# EAGLE design SparkFun_STUSB4500_USB-PD (EAGLE 9.6.0)
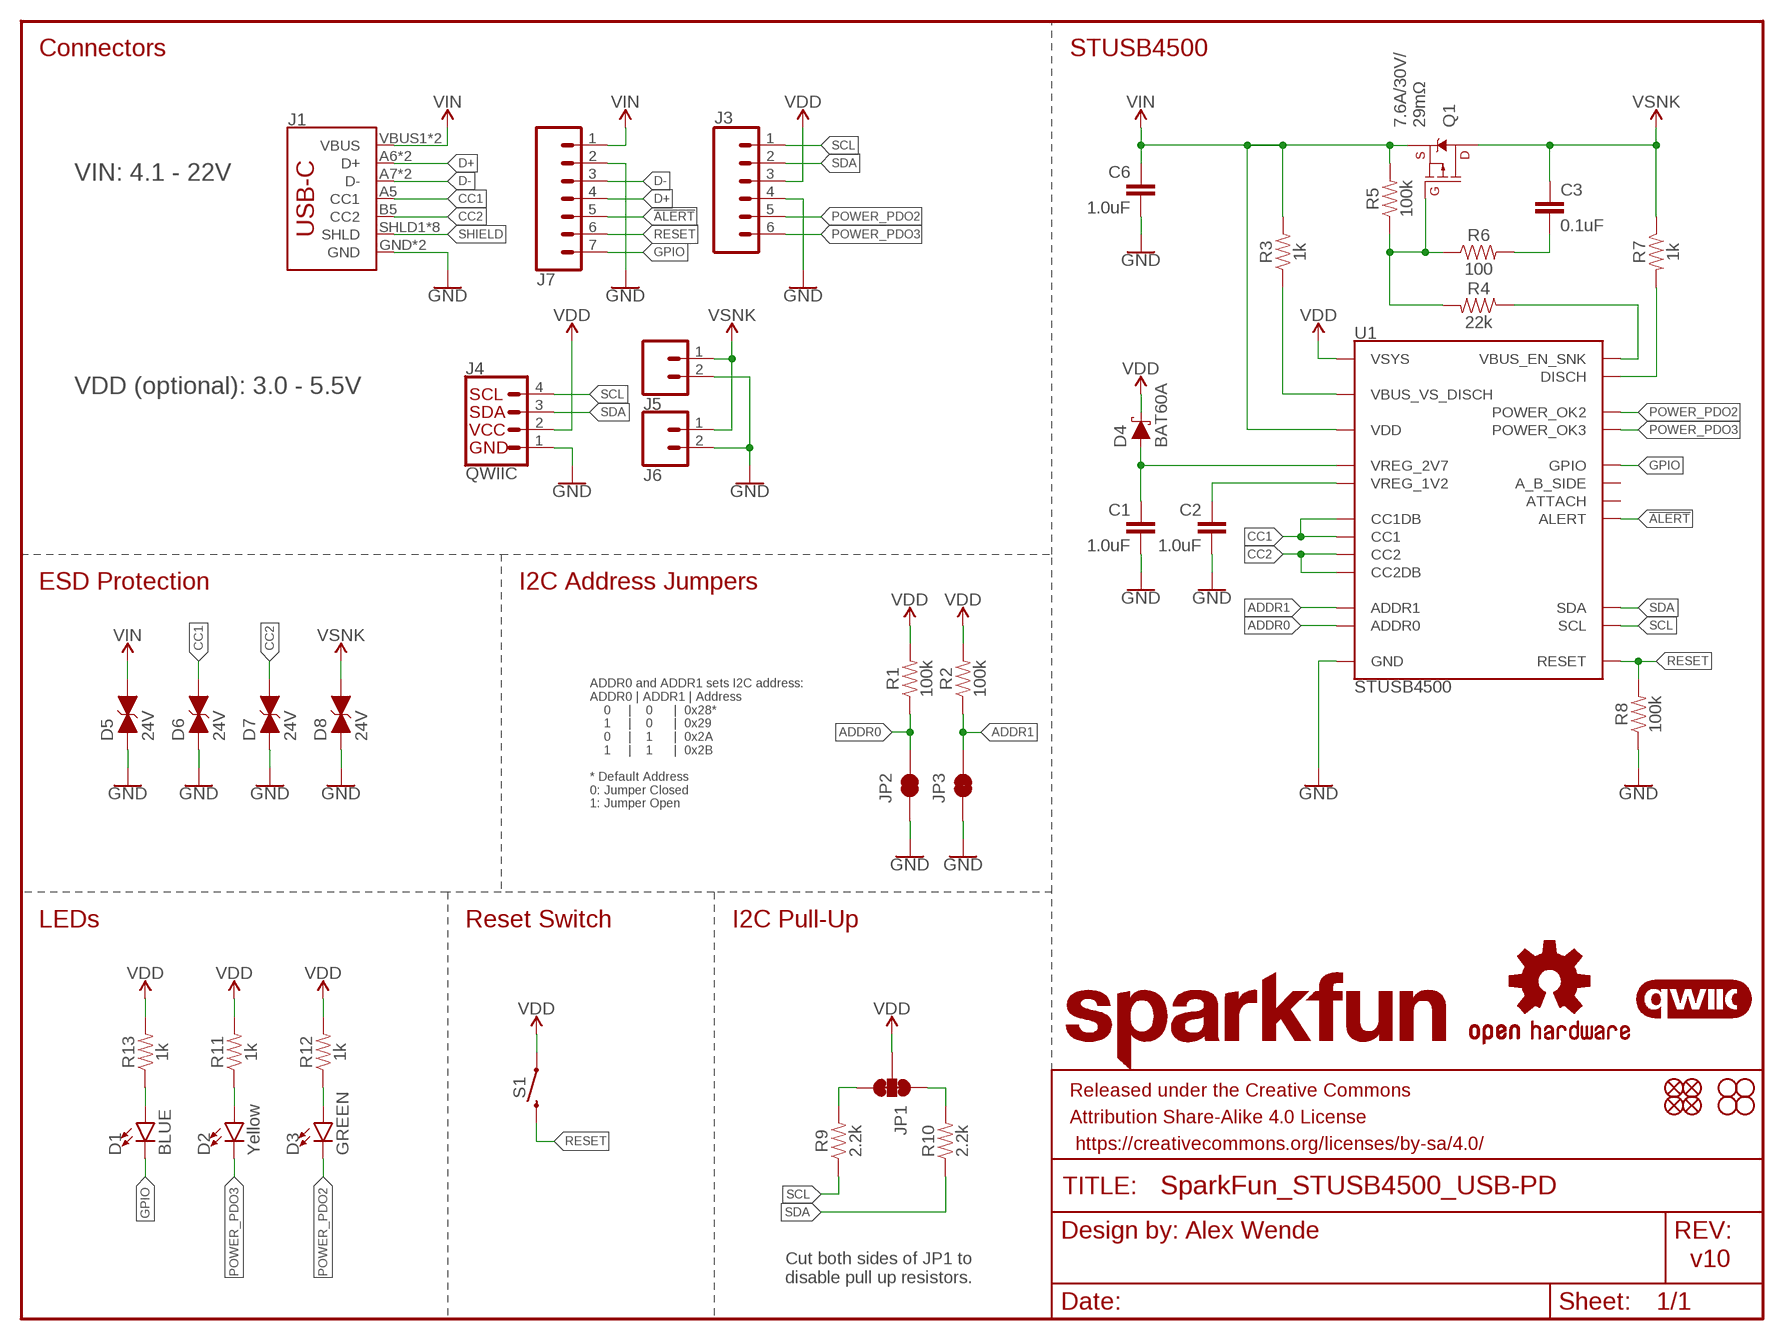
[diagram p0: schematic, sheet 1]

## Parts
C1  1.0uF  1.0UF-0603-16V-10%  [0603]
C2  1.0uF  1.0UF-0603-16V-10%  [0603]
C3  0.1uF  0.1UF-0603-100V-10%  [0603]
C6  1.0uF  1.0UF-0603-16V-10%  [0603]
D1  BLUE  LED-BLUE0603  [LED-0603]
D2  Yellow  LED-YELLOW0603  [LED-0603]
D3  GREEN  LED-GREEN0603  [LED-0603]
D4  BAT60A  DIODE-SCHOTTKY-BAT60A  [SOD-323]
D5  24V  DIODE_TVS  [0603]
D6  24V  DIODE_TVS  [0603]
D7  24V  DIODE_TVS  [0603]
D8  24V  DIODE_TVS  [0603]
FD1  FIDUCIALUFIDUCIAL  [FIDUCIAL-MICRO]
FD2  FIDUCIALUFIDUCIAL  [FIDUCIAL-MICRO]
FD3  FIDUCIALUFIDUCIAL  [FIDUCIAL-MICRO]
FD4  FIDUCIALUFIDUCIAL  [FIDUCIAL-MICRO]
FRAME1  FRAME-LETTER  [CREATIVE_COMMONS]
H1  STAND-OFF  [STAND-OFF]
H2  STAND-OFF  [STAND-OFF]
H3  STAND-OFF  [STAND-OFF]
H4  STAND-OFF  [STAND-OFF]
J1  USB_C2-LAYER  [USB-C-16P]
J3  CONN_06NO_SILK_NO_POP  [1X06_NO_SILK]
J4  QWIIC  QWIIC_CONNECTORJS-1MM  [JST04_1MM_RA]
J5  CONN_023.5MM  [SCREWTERMINAL-3.5MM-2]
J6  CONN_021X02_NO_SILK  [1X02_NO_SILK]
J7  CONN_07NO_SILK  [1X07_NO_SILK]
JP1  JUMPER-SMT_3_2-NC_TRACE_NO-SILK  [SMT-JUMPER_3_2-NC_TRACE_NO-SILK]
JP2  JUMPER-SMT_2_NC_TRACE_NO-SILK  [SMT-JUMPER_2_NC_TRACE_NO-SILK]
JP3  JUMPER-SMT_2_NC_TRACE_NO-SILK  [SMT-JUMPER_2_NC_TRACE_NO-SILK]
LOGO1  OSHW-LOGOS  [OSHW-LOGO-S]
LOGO2  SFE_LOGO_NAME.1_INCH  [SFE_LOGO_NAME_.1]
LOGO3  QWIIC_LOGO_5MM  [QWIIC_5MM]
Q1  9A/30V/15mΩ  MOSFET_PCH-STL9P3LLH6  [8-POWERVDFN-3X3]
R1  100k  100KOHM-0603-1/10W-1%  [0603]
R2  100k  100KOHM-0603-1/10W-1%  [0603]
R3  1k  1KOHM-0603-1/10W-1%  [0603]
R4  22k  22KOHM-0603-1/10W-1%  [0603]
R5  100k  100KOHM-0603-1/10W-1%  [0603]
R6  100  100OHM-0603-1/10W-1%  [0603]
R7  1k  1KOHM-0603-1/10W-1%  [0603]
R8  100k  100KOHM-0603-1/10W-1%  [0603]
R9  2.2k  2.2KOHM-0603-1/10W-1%  [0603]
R10  2.2k  2.2KOHM-0603-1/10W-1%  [0603]
R11  1k  1KOHM-0603-1/10W-1%  [0603]
R12  1k  1KOHM-0603-1/10W-1%  [0603]
R13  1k  1KOHM-0603-1/10W-1%  [0603]
S1  MOMENTARY-SWITCH-SPST-SMD-4.6X2.8MM  [TACTILE_SWITCH_SMD_4.6X2.8MM]
U1  STUSB4500  [QFN-24]

## Nets
1.2V: C2.1 U1.P$21(VREG_1V2)
2.7V: C1.1 D4.A U1.P$23(VREG_2V7)
!ALERT: J7.5 U1.P$19(ALERT)
ADDR0: JP2.2 R1.1 U1.P$12(ADDR0)
ADDR1: JP3.2 R2.1 U1.P$13(ADDR1)
CC1: D6.2(C) J1.A5(CC1) U1.P$1(CC1DB) U1.P$2(CC1)
CC2: D7.2(C) J1.B5(CC2) U1.P$4(CC2) U1.P$5(CC2DB)
D+: J1.A6(D+) J1.B6(D+) J7.4
D-: J1.A7(D-) J1.B7(D-) J7.3
DISCH: R7.2 U1.P$9(DISCH)
EN_SNK: R4.1 U1.P$16(VBUS_EN_SNK)
GND: C1.2 C2.2 C6.2 D5.1(A) D6.1(A) D7.1(A) D8.1(A) J1.GND J1.GND2(GND) J3.4 J4.1 J5.2 J6.2 J7.2 JP2.1 JP3.1 R8.1 U1.P$10(GND) U1.P$25(GND)
GPIO: D1.C J7.7 U1.P$15(GPIO)
N$1: D2.A R11.1
N$2: D3.A R12.1
N$5: JP1.3 R9.2
N$6: JP1.1 R10.2
N$8: Q1.4(G) R4.2 R5.1 R6.1
N$10: C3.2 R6.2
N$13: D1.A R13.1
POWER_PDO2: D3.C J3.5 U1.P$20(POWER_OK2)
POWER_PDO3: D2.C J3.6 U1.P$14(POWER_OK3)
RESET: J7.6 R8.2 S1.3 S1.4 U1.P$6(RESET)
SCL: J3.1 J4.4 R9.1 U1.P$7(SCL)
SDA: J3.2 J4.3 R10.1 U1.P$8(SDA)
SHIELD: J1.SHLD1(SHLD) J1.SHLD2(SHLD) J1.SHLD3(SHLD) J1.SHLD4(SHLD) J1.SHLD5(SHLD) J1.SHLD6(SHLD) J1.SHLD7(SHLD) J1.SHLD8(SHLD)
VBUS_VS_DISCH: R3.1 U1.P$18(VBUS_VS_DISCH)
VDD: D4.C J3.3 J4.2 JP1.2 R1.2 R2.2 R11.2 R12.2 R13.2 S1.1 S1.2 U1.P$22(VSYS)
VIN: C6.1 D5.2(C) J1.VBUS1(VBUS) J1.VBUS2(VBUS) J7.1 Q1.1(S) Q1.2(S) Q1.3(S) R3.2 R5.2 U1.P$24(VDD)
VSNK: C3.1 D8.2(C) J5.1 J6.1 Q1.5@1(D) Q1.5@2(D) Q1.5@3(D) R7.1
Unconnected: U1.P$11(ATTACH) U1.P$17(A_B_SIDE)

## Notes on the sheet
- Connectors | STUSB4500
- 7.6A/30V/
  29mΩ
- VIN: 4.1 - 22V
- VDD (optional): 3.0 - 5.5V
- ESD Protection | I2C Address Jumpers
- ADDR0 and ADDR1 sets I2C address:
  ADDR0 | ADDR1 | Address
      0     |    0      |  0x28*
      1     |    0      |  0x29
      0     |    1      |  0x2A
      1     |    1      |  0x2B
  
  * Default Address
  0: Jumper Closed
  1: Jumper Open
- LEDs | Reset Switch | I2C Pull-Up
- Alex Wende
- v10
- Cut both sides of JP1 to 
  disable pull up resistors.

## Library data of the parts
C1 C2 C6 = SparkFun-Capacitors:1.0UF: 1µF ceramic capacitors A capacitor is a passive two-terminal electrical component used to store electrical energy temporarily in an electric field.; PROD_ID: CAP-00868
C3 = SparkFun-Capacitors:0.1UF: 0.1µF ceramic capacitors A capacitor is a passive two-terminal electrical component used to store electrical energy temporarily in an electric field.; PROD_ID: CAP-08390
D1 = SparkFun-LED:LED-BLUE: Blue SMD LED Used in manufacturing of various products at SparkFun Packages: 0603 - SMD 0603 package [Product Link] <http://www.digikey.com/product-detail/en/SMLE12BC7TT86/511-1589-2-ND/1641808> 1206 - SMD1206 package [Product Link] <http://www.digikey.com/product-detail/en/lite-on-inc/LTST-C150TBKT/160-1643-1-ND/573584> SparkFun Products: ESP8266 Thing-Dev Board <https://www.sparkfun.com/products/13711> RedBoard <https://www.sparkfun.com/products/12757>; PROD_ID: DIO-08575
D2 = SparkFun-LED:LED-YELLOW: Yellow SMD LED Used in manufacturing several products at SparkFun. Packages: 0603 - SMD 0603 package[Product Link] <http://www.kingbrightusa.com/product.asp?catalog_name=LED&product_id=APT1608SYCK> 0603 -SMART - SMART SMD 0603 package (more efficient/more expensive) [Product Link] <http://www.osram-os.com/osram_os/en/products/product-catalog/led-light-emitting-diodes/smartled-0603/ly-l29k/index.jsp> LilyPad - SMD1206 package[Product Datasheet] <https://www.sparkfun.com/datasheets/DevTools/LilyPad/Q150YUS4.pdf> SparkFun Products: Blynk Board <https://www.sparkfun.com/products/13794> IOIO-OTG <https://www.sparkfun.com/products/13613> XBee Explorer Serial <https://www.sparkfun.com/products/13225>; PROD_ID: DIO-09003
D3 = SparkFun-LED:LED-GREEN: Green SMD LED Used in manufacturing of various products at SparkFun Packages: 0603 - SMD 0603 package [Product Link] <http://www.futureelectronics.com/en/technologies/semiconductors/optoelectronics/leds/Pages/9894312-LTST-C190GKT.aspx?CrossPart=HSMG-C190&IM=0> LilyPad 1206 - SMD1206 LilyPad package [Product Link] <http://www.futureelectronics.com/en/Technologies/Product.aspx?ProductID=IN150NGHARVATEKCORPORATION2049943&IM=0> 1206 - SMD1206 package [Product Link] <http://www.futureelectronics.com/en/technologies/semiconductors/optoelectronics/leds/Pages/8315665-LTST-C150KGKT.aspx?IM=0> 1206 Bottom Mount -SMD 1206 Bottom Mount [Product Link] <http://www.digikey.com/product-detail/en/lite-on-inc/LTST-C230KGKT/160-1456-1-ND/386854> SparkFun Products: Pro Mini 328 -5V <https://www.sparkfun.com/products/821> RedBoard <https://www.sparkfun.com/products/12757> MP3 Trigger <https://www.sparkfun.com/products/13720> Makey Makey <https://www.sparkfun.com/products/11076>; PROD_ID: DIO-00821
D4 = SparkFun-DiscreteSemi:DIODE-SCHOTTKY: Schottky diode A Schottky diode is a semiconductor diode which has a low forward voltage drop and a very fast switching action.; PROD_ID: DIO-14072; VALUE: 3A/10V/280mV
D5-D8 = SparkFun-DiscreteSemi:DIODE_TVS; PROD_ID: DIO-14502
FD1-FD4 = SparkFun-Aesthetics:FIDUCIAL: Fiducial Alignment Points Point-of-reference for pick-and-place machines and other optical instruments.
FRAME1 = SparkFun-Aesthetics:FRAME-LETTER: Schematic Frame - Letter Standard 8.5x11 US Letter frame
H1-H4 = SparkFun-Hardware:STAND-OFF: Stand Off Drill holes for mechanically mounting via screws, standoffs, etc. Note: Use the keepout ring to avoid running the screw head into surrounding components. Variant Overviews STAND-OFF - Mechanical footprint for a #4 phillips button head screw. STAND-OFF-TIGHT - Mechanical footprint for a #4 phillips button head screw, Example SparkFun Products Screw - Phillips Head (1/4", 4-40, 10 pack) <https://www.sparkfun.com/products/10453> (PRT-10453) Screw - Phillips Head (1/2", 4-40, 10 pack) <https://www.sparkfun.com/products/10452> (PRT-10452) Screw - Phillips Head (3/4", 4-40, 10 pack) <https://www.sparkfun.com/products/10451> (PRT-10451) Screw - Phillips Head (1", 4-40, 10 pack) <https://www.sparkfun.com/products/10450> (PRT-10450)
J1 = SparkFun-Connectors:USB_C: USB Type C 16Pin Connector Super Speed pins not available on the 16-pin purely SMD connector so this part is best for USB 2.0 implementations. D1 and D2 are tied together enabling D+/- no matter which way the cable is plugged into the connector. The two channel configuration pins (CC1/2) are exposed. These are normally connected to ground via 5.1k resistors but can be reconfigured for high current/high power applications.; PROD_ID: CONN-14122
J3 = SparkFun-Connectors:CONN_06: Multi connection point. Often used as Generic Header-pin footprint for 0.1 inch spaced/style header connections On any of the 0.1 inch spaced packages, you can populate with these: Break Away Headers - Straight <https://www.sparkfun.com/products/116> (PRT-00116) Break Away Male Headers - Right Angle <https://www.sparkfun.com/products/553> (PRT-00553) Female Headers <https://www.sparkfun.com/products/115> (PRT-00115) Break Away Headers - Machine Pin <https://www.sparkfun.com/products/117> (PRT-00117) Break Away Female Headers - Swiss Machine Pin <https://www.sparkfun.com/products/743> (PRT-00743) Arduino Stackable Header - 6 Pin <https://www.sparkfun.com/products/9280> (PRT-09280) For SCREWTERMINALS and SPRING TERMINALS visit here: Screw Terimnals on SparkFun.com <https://www.sparkfun.com/search/results?term=Screw+Terminals> (5mm/3.5mm/2.54mm spacing) This device is also useful as a general connection point to wire up your design to another part of your project. Our various solder wires solder well into these plated through hole pads. Hook-Up Wire - Assortment (Stranded, 22 AWG) <https://www.sparkfun.com/products/11375> (PRT-11375) Hook-Up Wire - Assortment (Solid Core, 22 AWG) <https://www.sparkfun.com/products/11367> (PRT-11367) View the entire wire category on our website here <https://www.sparkfun.com/categories/141>
J4 = SparkFun-Connectors:QWIIC_CONNECTOR: SparkFun I2C Standard Qwiic Connector An SMD 1mm pitch JST connector makes it easy and quick (get it? Qwiic?) to connect I2C devices to each other. The Qwiic system <http://www.sparkfun.com/qwiic> enables fast and solderless connection between popular platforms and various sensors and actuators. We carry 200mm <https://www.sparkfun.com/products/14204>, 100mm <https://www.sparkfun.com/products/14205>, 50mm <https://www.sparkfun.com/products/14206>, and breadboard friendly <https://www.sparkfun.com/products/14207> Qwiic cables. We also offer 10 pcs strips <https://www.sparkfun.com/products/14323> the SMD connectors.; PROD_ID: CONN-13694; VALUE: QWIIC_RIGHT_ANGLE
J5 = SparkFun-Connectors:CONN_02: Multi connection point. Often used as Generic Header-pin footprint for 0.1 inch spaced/style header connections On any of the 0.1 inch spaced packages, you can populate with these: Break Away Headers - Straight <https://www.sparkfun.com/products/116> (PRT-00116) Break Away Male Headers - Right Angle <https://www.sparkfun.com/products/553> (PRT-00553) Female Headers <https://www.sparkfun.com/products/115> (PRT-00115) Break Away Headers - Machine Pin <https://www.sparkfun.com/products/117> (PRT-00117) Break Away Female Headers - Swiss Machine Pin <https://www.sparkfun.com/products/743> (PRT-00743) For SCREWTERMINALS and SPRING TERMINALS visit here: Screw Terimnals on SparkFun.com <https://www.sparkfun.com/search/results?term=Screw+Terminals> (5mm/3.5mm/2.54mm spacing) This device is also useful as a general connection point to wire up your design to another part of your project. Our various solder wires solder well into these plated through hole pads. Hook-Up Wire - Assortment (Stranded, 22 AWG) <https://www.sparkfun.com/products/11375> (PRT-11375) Hook-Up Wire - Assortment (Solid Core, 22 AWG) <https://www.sparkfun.com/products/11367> (PRT-11367) View the entire wire category on our website here <https://www.sparkfun.com/categories/141> Special notes: Molex polarized connector foot print use with: PRT-08233 with associated crimp pins and housings. 2.54_SCREWTERM for use with PRT-10571. 3.5mm Screw Terminal footprints for PRT-08084 5mm Screw Terminal footprints for use with PRT-08432; PROD_ID: CONN-08399
J6 = SparkFun-Connectors:CONN_02: Multi connection point. Often used as Generic Header-pin footprint for 0.1 inch spaced/style header connections On any of the 0.1 inch spaced packages, you can populate with these: Break Away Headers - Straight <https://www.sparkfun.com/products/116> (PRT-00116) Break Away Male Headers - Right Angle <https://www.sparkfun.com/products/553> (PRT-00553) Female Headers <https://www.sparkfun.com/products/115> (PRT-00115) Break Away Headers - Machine Pin <https://www.sparkfun.com/products/117> (PRT-00117) Break Away Female Headers - Swiss Machine Pin <https://www.sparkfun.com/products/743> (PRT-00743) For SCREWTERMINALS and SPRING TERMINALS visit here: Screw Terimnals on SparkFun.com <https://www.sparkfun.com/search/results?term=Screw+Terminals> (5mm/3.5mm/2.54mm spacing) This device is also useful as a general connection point to wire up your design to another part of your project. Our various solder wires solder well into these plated through hole pads. Hook-Up Wire - Assortment (Stranded, 22 AWG) <https://www.sparkfun.com/products/11375> (PRT-11375) Hook-Up Wire - Assortment (Solid Core, 22 AWG) <https://www.sparkfun.com/products/11367> (PRT-11367) View the entire wire category on our website here <https://www.sparkfun.com/categories/141> Special notes: Molex polarized connector foot print use with: PRT-08233 with associated crimp pins and housings. 2.54_SCREWTERM for use with PRT-10571. 3.5mm Screw Terminal footprints for PRT-08084 5mm Screw Terminal footprints for use with PRT-08432
J7 = SparkFun-Connectors:CONN_07: Multi connection point. Often used as Generic Header-pin footprint for 0.1 inch spaced/style header connections On any of the 0.1 inch spaced packages, you can populate with these: Break Away Headers - Straight <https://www.sparkfun.com/products/116> (PRT-00116) Break Away Male Headers - Right Angle <https://www.sparkfun.com/products/553> (PRT-00553) Female Headers <https://www.sparkfun.com/products/115> (PRT-00115) Break Away Headers - Machine Pin <https://www.sparkfun.com/products/117> (PRT-00117) Break Away Female Headers - Swiss Machine Pin <https://www.sparkfun.com/products/743> (PRT-00743) For SCREWTERMINALS and SPRING TERMINALS visit here: Screw Terimnals on SparkFun.com <https://www.sparkfun.com/search/results?term=Screw+Terminals> (5mm/3.5mm/2.54mm spacing) This device is also useful as a general connection point to wire up your design to another part of your project. Our various solder wires solder well into these plated through hole pads. Hook-Up Wire - Assortment (Stranded, 22 AWG) <https://www.sparkfun.com/products/11375> (PRT-11375) Hook-Up Wire - Assortment (Solid Core, 22 AWG) <https://www.sparkfun.com/products/11367> (PRT-11367) View the entire wire category on our website here <https://www.sparkfun.com/categories/141> Special notes: Molex polarized connector foot print use with SKU : PRT-08231 with associated crimp pins and housings. 1MM SMD Version SKU: PRT-10208 NOTES ON THE VARIANTS LOCK and LOCK_LONGPADS... This footprint was designed to help hold the alignment of a through-hole component (i.e. 6-pin header) while soldering it into place. You may notice that each hole has been shifted either up or down by 0.005 of an inch from it's more standard position (which is a perfectly straight line). This slight alteration caused the pins (the squares in the middle) to touch the edges of the holes. Because they are alternating, it causes a "brace" to hold the component in place. 0.005 has proven to be the perfect amount of "off-center" position when using our standard breakaway headers. Although looks a little odd when you look at the bare footprint, once you have a header in there, the alteration is very hard to notice. Also,if you push a header all the way into place, it is covered up entirely on the bottom side.
JP1 = SparkFun-Jumpers:JUMPER-SMT_3_2-NC_TRACE: Normally closed trace jumper (2 of 2 connections) This jumper has a trace between all three pads so they are normally closed (NC). Use a razor knife to open the connection(s). For best results follow the IPC guidelines for cutting traces: Cutout at least 0.063 mm (0.005 in). Remove all loose material to clean up the cut area. Seal the cut with an approved epoxy. Reapply solder to reclose the connection(s).
JP2 JP3 = SparkFun-Jumpers:JUMPER-SMT_2_NC_TRACE: Normally closed trace jumper This jumper has a trace between two pads so it's normally closed (NC). Use a razor knife to open the connection. For best results follow the IPC guidelines for cutting traces: Cutout at least 0.063 mm (0.005 in). Remove all loose material to clean up the cut area. Seal the cut with an approved epoxy. Reapply solder to reclose the connection.
LOGO1 = SparkFun-Aesthetics:OSHW-LOGO: Open-Source Hardware (OSHW) Logo This logo indicates the piece of hardware it is found on incorporates a OSHW license and/or adheres to the definition of open source hardware found here: http://freedomdefined.org/OSHW
LOGO2 = SparkFun-Aesthetics:SFE_LOGO_NAME: SparkFun Font Logo This is the SparkFun name logo. The logo on the schematic will always be the same size; the package variant is the height of the flame part of the logo (or the height the flame would be, if it were drawn). Default layer for the logo on the board is tSilk.
LOGO3 = SparkFun-Aesthetics:QWIIC_LOGO: Qwiic Logos for placement on schematic and PCB. The 5.5mm silk logo is best for placing next to Qwiic connector.
Q1 = SparkFun-DiscreteSemi:MOSFET_PCH: P-channel MOSFETs Voltage controlled devices that allow control of high current outputs. SparkFun Products: SparkFun ESP32 Thing <https://www.sparkfun.com/products/13907> SparkFun ESP8266 Thing <https://www.sparkfun.com/products/13231> SparkFun Pi Servo HAT V2 <https://www.sparkfun.com/products/15316> DMG2305UX-7 (20V/4.2A/SOT23-3); PROD_ID: TRANS-14715
R1 R2 R5 R8 = SparkFun-Resistors:100KOHM: 100kΩ resistor A resistor is a passive two-terminal electrical component that implements electrical resistance as a circuit element. Resistors act to reduce current flow, and, at the same time, act to lower voltage levels within circuits. - Wikipedia; PROD_ID: RES-07828
R3 R7 R11-R13 = SparkFun-Resistors:1KOHM: 1kΩ resistor A resistor is a passive two-terminal electrical component that implements electrical resistance as a circuit element. Resistors act to reduce current flow, and, at the same time, act to lower voltage levels within circuits. - Wikipedia; PROD_ID: RES-07856
R4 = SparkFun-Resistors:22KOHM: 22kΩ resistor A resistor is a passive two-terminal electrical component that implements electrical resistance as a circuit element. Resistors act to reduce current flow, and, at the same time, act to lower voltage levels within circuits. - Wikipedia; PROD_ID: RES-07853
R6 = SparkFun-Resistors:100OHM: 100Ω resistor A resistor is a passive two-terminal electrical component that implements electrical resistance as a circuit element. Resistors act to reduce current flow, and, at the same time, act to lower voltage levels within circuits. - Wikipedia; PROD_ID: RES-07863
R9 R10 = SparkFun-Resistors:2.2KOHM: 2.2kΩ resistor A resistor is a passive two-terminal electrical component that implements electrical resistance as a circuit element. Resistors act to reduce current flow, and, at the same time, act to lower voltage levels within circuits. - Wikipedia; PROD_ID: RES-08272
S1 = SparkFun-Switches:MOMENTARY-SWITCH-SPST: Momentary Switch (Pushbutton) - SPST Normally-open (NO) SPST momentary switches (buttons, pushbuttons). Variants PTH-12MM - 12mm square, through-hole Momentary Pushbutton Switch - 12mm Square <https://www.sparkfun.com/products/9190> (COM-09190) PTH-6.0MM, PTH-6.0MM-KIT - 6.0mm square, through-hole Mini Pushbutton Switch <https://www.sparkfun.com/products/97> (COM-00097) KIT package intended for soldering kit's - only one side of pads' copper is exposed. PTH-RIGHT-ANGLE-KIT - Right-angle, through-hole Right Angle Tactile Button <https://www.sparkfun.com/products/10791> - Used on SparkFun BigTime Watch Kit <https://www.sparkfun.com/products/11734> SMD-12MM - 12mm square, surface-mount Tactile Button - SMD (12mm) <https://www.sparkfun.com/products/12993> (COM-12993) Used on SparkFun PicoBoard <https://www.sparkfun.com/products/11888> SMD-4.5MM - 4.5mm Square Trackball Switch Used on SparkFun Blackberry Trackballer Breakout <https://www.sparkfun.com/products/13169> SMD-4.6MMX2.8MM - 4.60mm x 2.80mm, surface mount Used on SparkFun SAMD21 Mini Breakout <https://www.sparkfun.com/products/13664> SMD-5.2MM, SMD-5.2-REDUNDANT - 5.2mm square, surface-mount Mini Pushbutton Switch - SMD <https://www.sparkfun.com/products/8720> (COM-08720) Used on Arduino Pro Mini <https://www.sparkfun.com/products/11114> REDUNDANT package connects both switch circuits together SMD-6.0X3.5MM - 6.0 x 3.5mm, surface mount Momentary Reset Switch SMD <https://www.sparkfun.com/products/8229> (COM-08229) SMD-6.2MM-TALL - 6.2mm square, surface mount Tactile Button - SMD (6mm) <https://www.sparkfun.com/products/12992> Used on SparkFun Digital Sandbox <https://www.sparkfun.com/products/12651> SMD-RIGHT-ANGLE - Right-angle, surface mount Used on SparkFun Block for Intel® Edison - Arduino <https://www.sparkfun.com/products/13036>; PROD_ID: SWCH-13065
U1 = SparkFun-IC-Power:STUSB4500; PROD_ID: IC-14684

## Board
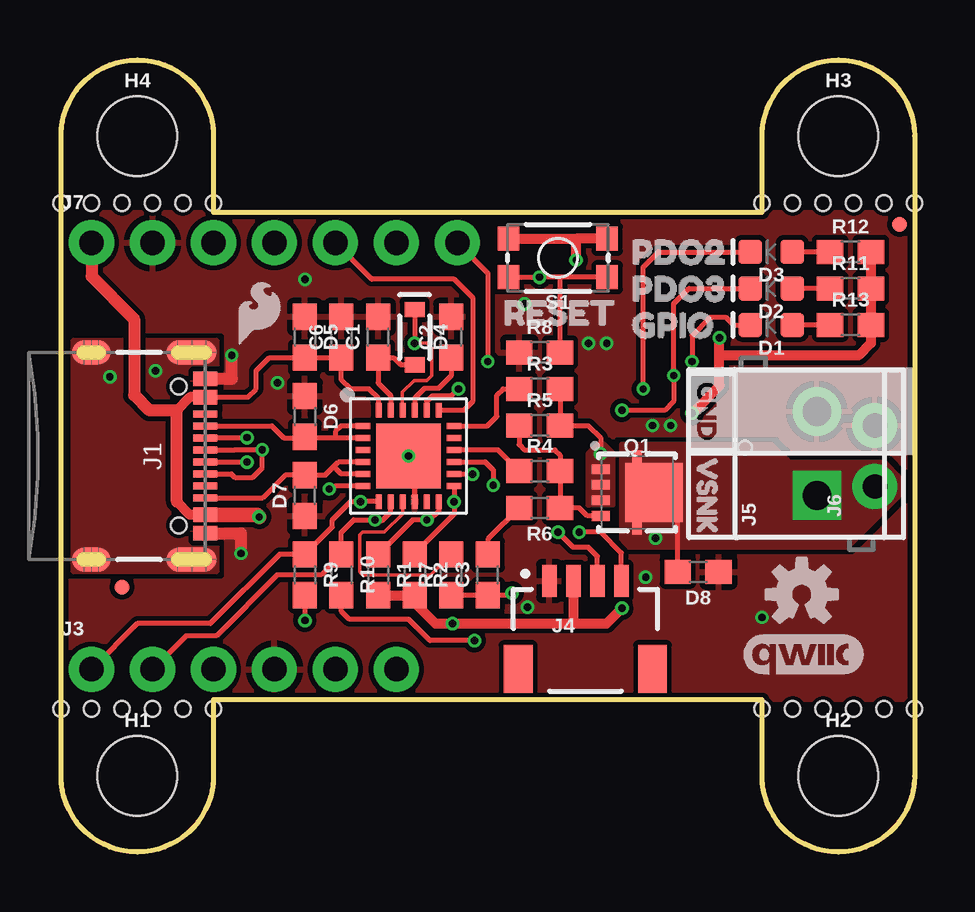
[diagram p1: board, top side]
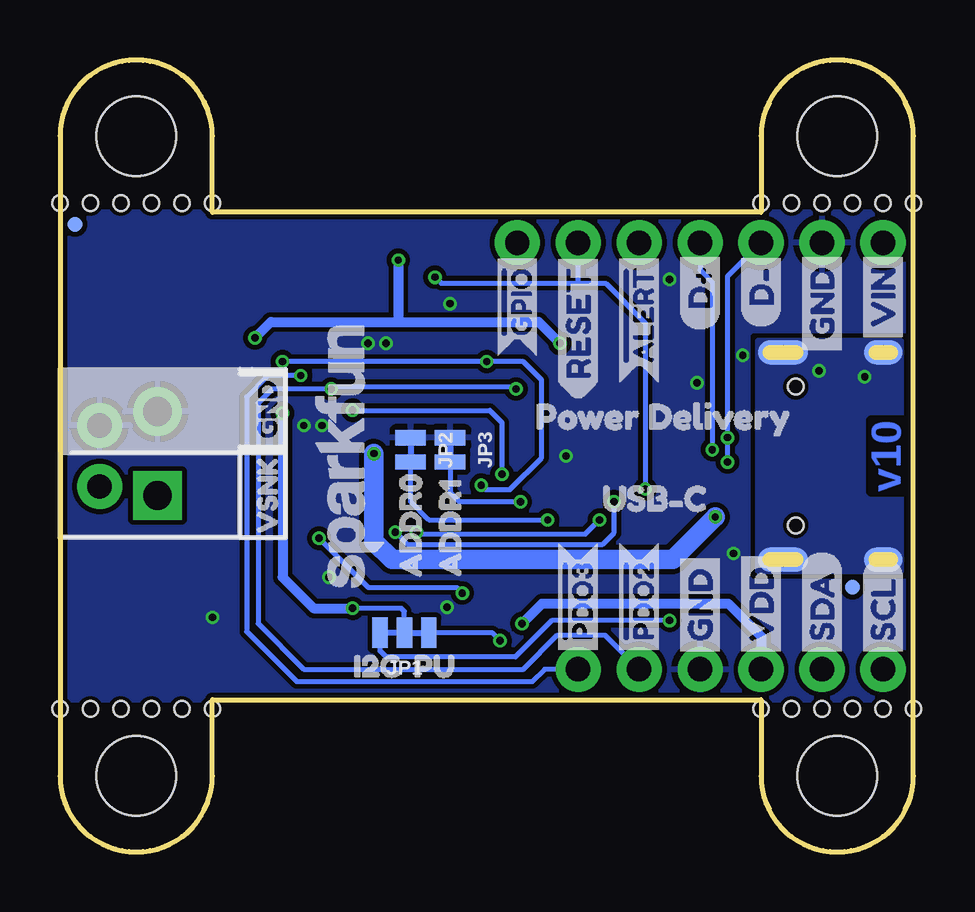
[diagram p2: board, bottom side, seen from below]

Size 35.56 x 33.02 mm. Coordinates in mm from the lower left corner, seen from the top.
Outline: 6.35,26.67 29.21,26.67 29.21,29.84 arc-90 32.38,33.02 arc-90 35.56,29.84 35.56,3.17 arc-90 32.38,0 arc-90 29.21,3.17 29.21,6.35 6.35,6.35 6.35,3.17 arc-90 3.17,0 arc-90 0,3.17 0,29.84 arc-90 3.17,33.02 arc-90 6.35,29.84 6.35,26.67
Copper layers (1*16): Top 0.035mm / dielectric 1.5mm / Bottom 0.035mm
Design rules "SparkFun-2-layer-FAB-LIMIT": minimum track width 4mil, minimum drill 6mil, track to track 4mil, track to pad 4mil, pad to pad 4mil, via to via 4mil, smd to smd 4mil, copper to edge 4mil, drill to drill 4mil, minimum pad ring 5mil, minimum via ring 5mil, stop-mask expansion 4mil, vias tented up to drill 25mil, thermal gap 10mil
Holes 0.64 mm at 3.81,5.97 2.54,5.97 1.27,5.97 0,5.97 5.08,5.97 6.35,5.97 33.02,5.97 31.75,5.97 30.48,5.97 29.21,5.97 34.29,5.97 35.56,5.97 2.54,27.05 3.81,27.05 5.08,27.05 6.35,27.05 1.27,27.05 0,27.05 31.75,27.05 33.02,27.05 34.29,27.05 35.56,27.05 30.48,27.05 29.21,27.05
tRestrict: 4 lines

### Footprints (pad centres in the part's own frame; a part is rotated, then mirrored left to right if it is on the bottom)
0603 = smd 1.1 x 1: 1 -0.85,0; 2 0.85,0
LED-0603 = smd 1 x 1: A -0.877,0; C 0.877,0
SOD-323 = smd 0.63 x 0.83: A 1.15,0; C -1.15,0
FIDUCIAL-MICRO = smd 0.635 x 0.635: 1 0,0
STAND-OFF = hole 3.302: 0,0
USB-C-16P = smd 0.3 x 1: A5 -1.25,-0.34; A6 -0.25,-0.34; A7 0.25,-0.34; A8 1.25,-0.34; B5 1.75,-0.34; B6 0.75,-0.34; B7 -0.75,-0.34; B8 -1.75,-0.34 | smd 0.6 x 1: GND -3.225,-0.34; GND2 3.225,-0.34; VBUS1 -2.45,-0.34; VBUS2 2.45,-0.34 | smd 1 x 2.1: SHLD1 -4.32,-0.915; SHLD2 4.32,-0.915 | smd 1 x 2.1 bottom: SHLD3 -4.32,-0.915; SHLD4 4.32,-0.915 | smd 1 x 1.6: SHLD5 -4.32,-5.095; SHLD8 4.32,-5.095 | smd 1 x 1.6 bottom: SHLD6 -4.32,-5.095; SHLD7 4.32,-5.095 | hole 0.65: -2.89,-1.445; 2.89,-1.445
1X06_NO_SILK = drill 1.016 pad 1.88: 1 0,0; 2 2.54,0; 3 5.08,0; 4 7.62,0; 5 10.16,0; 6 12.7,0
JST04_1MM_RA = smd 0.6 x 1.35: 1 -1.5,0; 2 -0.5,0; 3 0.5,0; 4 1.5,0 | smd 1.2 x 2: NC1 2.8,-3.675; NC2 -2.8,-3.675
SCREWTERMINAL-3.5MM-2 = drill 1.2 pad 2.032 square: 1 0,0 | drill 1.2 pad 2.032: 2 3.5,0
1X02_NO_SILK = drill 1.016 pad 1.88: 1 0,0; 2 2.54,0
1X07_NO_SILK = drill 1.016 pad 1.88: 1 0,0; 2 2.54,0; 3 5.08,0; 4 7.62,0; 5 10.16,0; 6 12.7,0; 7 15.24,0
SMT-JUMPER_3_2-NC_TRACE_NO-SILK = smd 0.635 x 1.27: 1 -1.016,0; 2 0,0; 3 1.016,0
SMT-JUMPER_2_NC_TRACE_NO-SILK = smd 0.635 x 1.27: 1 -0.508,0; 2 0.508,0
8-POWERVDFN-3X3 = smd 0.4 x 0.75: 1 -0.975,-1.525; 2 -0.325,-1.525; 3 0.325,-1.525; 4 0.975,-1.525 | smd 2.45 x 2.4: 5@1 0,0.7 | smd 0.53 x 0.4: 5@2 -1.49,0; 5@3 1.49,0
TACTILE_SWITCH_SMD_4.6X2.8MM = smd 0.9 x 1: 1 -2.05,-0.8; 2 2.05,-0.8; 3 2.05,0.8; 4 -2.05,0.8
QFN-24 = smd 0.6 x 0.25: P$1 -1.9,1.25; P$2 -1.9,0.75; P$3 -1.9,0.25; P$4 -1.9,-0.25; P$5 -1.9,-0.75; P$6 -1.9,-1.25; P$13 1.9,-1.25; P$14 1.9,-0.75; P$15 1.9,-0.25; P$16 1.9,0.25; P$17 1.9,0.75; P$18 1.9,1.25 | smd 0.25 x 0.6: P$7 -1.25,-1.9; P$8 -0.75,-1.9; P$9 -0.25,-1.9; P$10 0.25,-1.9; P$11 0.75,-1.9; P$12 1.25,-1.9; P$19 1.25,1.9; P$20 0.75,1.9; P$21 0.25,1.9; P$22 -0.25,1.9; P$23 -0.75,1.9; P$24 -1.25,1.9 | smd 2.7 x 2.7: P$25 0,0

### Placement (x,y rotation side)
C1  13.21,21.46 90 top
C2  16.26,21.46 90 top
C3  17.78,11.56 90 top
C6  11.68,21.46 90 top
D1  29.59,21.97 180 top
D2  29.59,23.5 180 top
D3  29.59,25.02 180 top
D4  14.73,21.46 270 top
D5  10.16,21.46 270 top
D6  10.16,18.16 270 top
D7  10.16,14.86 90 top
D8  26.54,11.68 180 top
FD1  2.54,11.05 0 top
FD2  34.92,26.16 0 top
FD3  34.92,26.16 0 bottom
FD4  2.54,11.05 0 bottom
FRAME1  -8.89,-19.43 0 top  (outside the outline)
H1  3.17,3.17 0 top
H2  32.38,3.17 0 top
H3  32.38,29.84 0 top
H4  3.17,29.84 0 top
J1  6.35,16.51 270 top
J3  1.27,7.62 0 top
J4  21.84,11.3 0 top
J5  31.5,14.86 90 top
J6  33.91,15.24 90 top
J7  1.27,25.4 0 top
JP1  21.21,9.14 180 bottom
JP2  20.95,16.76 270 bottom
JP3  19.3,16.76 270 bottom
LOGO1  30.86,10.74 0 top
LOGO2  23.5,16.51 90 bottom
LOGO3  30.91,8.26 0 top
Q1  24,14.99 270 top
R1  13.21,11.56 270 top
R2  14.73,11.56 270 top
R3  19.94,19.3 0 top
R4  19.94,15.88 0 top
R5  19.94,17.78 0 top
R6  19.94,14.35 180 top
R7  16.26,11.56 90 top
R8  19.94,20.83 0 top
R9  10.16,11.56 270 top
R10  11.68,11.56 270 top
R11  32.89,23.5 0 top
R12  32.89,25.02 0 top
R13  32.89,21.97 0 top
S1  20.7,24.77 180 top
U1  14.48,16.51 0 top
U$1  [VDD2]  6.35,7.87 90 bottom
U$2  [GND6]  8.89,7.87 90 bottom
U$3  [SDA11]  3.81,7.87 90 bottom
U$4  [SCL12]  1.27,7.87 90 bottom
U$5  [#GPIO0]  16.51,20.42 90 bottom
U$7  [D#8]  6.35,21.84 90 bottom
U$8  [D#7]  8.89,21.72 90 bottom
U$9  [USB#C1]  13.89,14.73 0 bottom
U$10  [RESET10]  13.97,18.8 90 bottom
U$11  [GND6]  3.81,20.45 90 bottom
U$12  [VIN6]  1.27,20.95 90 bottom
U$13  [I2C2]  24.13,7.75 0 bottom
U$14  [PU3]  21.59,7.75 0 bottom
U$15  [ADDR00]  20.95,10.69 90 bottom
U$16  [ADDR11]  19.3,10.69 90 bottom
U$17  [RESET7]  17.53,22.48 0 top
U$18  [GPIO1]  22.86,21.97 0 top
U$19  [PDO24]  22.86,25.02 0 top
U$20  [PDO35]  22.86,23.5 0 top
U$21  [VSNK1]  26.92,17.14 270 top
U$22  [GND0]  26.92,20.32 270 top
U$23  [GND0]  26.92,16.51 90 bottom
U$24  [VSNK1]  26.92,12.57 90 bottom
U$25  [SFE_LOGO_FLAME_.1]  8.26,22.48 0 top
U$26  [#ALERT0]  11.43,19.3 90 bottom
U$27  [_POWER_DELIVERY2]  17.02,18.16 0 bottom
U$29  [#PDO20]  11.43,7.75 90 bottom
U$30  [#PDO31]  13.97,7.75 90 bottom

### Tracks (layer width: path | path; a pad name or v marks a point on that pad's centre or on a via)
1.2V
  Top 0.203: C2.1 16.26,19.86 15.73,19.33 15.14,19.33 14.73,18.92 U1.P$21
2.7V
  Top 0.203: U1.P$23 13.73,19.04 13.21,19.56 C1.1 13.86,20.61 14.15,20.31 D4.A
!ALERT
  Top 0.203: J7.5 12.95,23.88 16.38,23.88 17.14,23.11 17.14,18.77 16.78,18.41 U1.P$19
ADDR0  (via drill 0.3)
  Top 0.203: U1.P$12 15.73,14.2 15.37,13.84 v15.24,13.84 14.64,13.84 R1.1
  Bottom 0.203: v15.24,13.84 20.19,13.84 20.95,14.61 JP2.2
ADDR1  (via drill 0.3)
  Top 0.203: U1.P$13 v16.38,14.61 16.38,14.09 14.73,12.45 R2.1
  Bottom 0.203: JP3.2 19.3,14.99 18.92,14.61 v16.38,14.61
CC1
  Top 0.203: U1.P$2 11.43,17.26 | 11.43,17.26 10.21,17.26 | 10.21,17.26 D6.2 | J1.A5 8.78,17.76 9.28,17.26 10.21,17.26 | U1.P$1 11.66,17.76 11.43,17.53 11.43,17.26
CC2
  Top 0.203: J1.B5 8.4,14.76 9.35,15.71 D7.2 11.01,15.71 11.37,16.07 | 11.37,16.07 11.56,16.26 U1.P$4 | 11.37,16.07 11.67,15.76 U1.P$5
D+  (via drill 0.3)
  Top 0.203: J1.B6 7.1,15.76 7.24,15.62 7.99,15.62 8.38,16.01 v8.38,16.78 8.37,16.76 7.24,16.76 J1.A6
  Bottom 0.203: v8.38,16.78 8.38,23.75 8.83,24.19 8.89,24.26 J7.4
D-  (via drill 0.3)
  Top 0.203: J1.A7 v7.75,16.26 | J1.B7 6.01,17.28 v7.75,17.28
  Bottom 0.203: v7.75,16.26 v7.75,17.28 7.75,24 J7.3
DISCH
  Top 0.152: U1.P$9 14.23,14.1 13.46,13.34 12.57,13.34 12.45,13.21 12.45,11.68 12.57,11.56 15.41,11.56 R7.2
EN_SNK
  Top 0.203: R4.1 18.2,16.76 U1.P$16
GND  (via drill 0.3)
  Top 0.203: U1.P$10 14.73,16.26 U1.P$25 14.23,16.76
  Top 0.508: J1.GND 7.11,19.73 v7.11,20.7 | J1.GND2 7.49,13.29 v7.49,12.45
  other vias: 14.48,16.51 24.36,11.46 19.3,22.86 9.02,19.56 19.43,10.21 10.16,23.88 29.21,9.78 25.4,17.78 22.73,21.21 21.97,21.21 24.64,17.78
  pour Top (isolate 0.203, rank 2): 0,26.67 35.56,26.67 35.56,6.35 0,6.35
  pour Bottom (isolate 0.203, rank 2): 0,26.67 35.56,26.67 35.56,6.35 0,6.35
GPIO  (via drill 0.3)
  Top 0.203: v18.01,15.29 18.01,15.92 17.67,16.26 U1.P$15 | D1.C 28.03,21.97 27.72,22.28 27.03,22.28 26.29,21.54 v26.29,20.45 | J7.7 17.78,24.13 v17.78,20.45
  Bottom 0.203: v18.01,15.29 17.83,15.11 16.82,15.11 15.49,16.43 15.49,19.68 16.26,20.45 v17.78,20.45 v26.29,20.45
N$1
  Top 0.203: R11.1 D2.A
N$2
  Top 0.203: R12.1 D3.A
N$5  (via drill 0.3)
  Top 0.203: R9.2 v10.16,9.65
  Bottom 0.203: v10.16,9.65 15.06,9.65 16.59,8.13 21.97,8.13 22.23,8.38 JP1.3
N$6  (via drill 0.3)
  Top 0.203: R10.2 11.68,10.03 12.01,9.7 14.48,9.7 15.37,8.81 v17.22,8.81
  Bottom 0.203: v17.22,8.81 17.55,9.14 JP1.1
N$8
  Top 0.203: R5.1 19.09,16.98 19.3,16.76 20.57,16.76 20.79,16.55 R4.2 R6.1 21.59,14.35 21.93,14.01 Q1.4
N$10
  Top 0.203: R6.2 17.78,13.04 C3.2
N$13
  Top 0.203: R13.1 D1.A
POWER_PDO2  (via drill 0.3)
  Top 0.203: v24.26,19.3 24.26,24.38 24.89,25.02 D3.C | v16.56,19.3 16.26,19 15.44,19 15.23,18.78 U1.P$20
  Bottom 0.203: v16.56,19.3 16.66,19.41 24.18,19.41 24.26,19.33 v24.26,19.3 26.72,19.3 27.3,18.72 27.3,9.53 25.4,7.62 16.26,7.62 14.83,9.04 12.85,9.04 J3.5
POWER_PDO3  (via drill 0.3)
  Top 0.203: U1.P$14 v17.14,15.76 v17.14,15.75 | v23.37,18.41 25.15,18.41 25.53,18.8 v25.53,19.86 25.53,22.86 26.16,23.5 D2.C
  Bottom 0.203: v23.37,18.41 17.65,18.41 17.14,17.91 v17.14,15.75 | v25.53,19.86 26.9,19.86 27.79,18.97 27.79,9.2 25.7,7.11 15.88,7.11 15.37,7.62 J3.6
RESET  (via drill 0.3)
  Top 0.203: U1.P$6 11.44,15.26 11.31,15.13 v11.18,15.13 | S1.4 20.79,23.96 | S1.3 v19.94,23.96 20.79,23.96 | R8.2 20.79,23.96
  Bottom 0.203: v11.18,15.13 11.18,22.06 12.83,23.71 13.97,23.71 | v19.94,23.96 19.68,23.71 13.97,23.71 | 13.97,23.71 J7.6
SCL  (via drill 0.3)
  Top 0.203: J4.4 23.34,12.47 22.48,13.34 v21.59,13.34 | U1.P$7 v12.47,14.61 12.06,14.61 11.3,13.84 11.3,13.55 R9.1 9.11,12.41 6.22,9.53 3.17,9.53 J3.1
  Bottom 0.203: v21.59,13.34 21.08,12.83 12.95,12.83 12.47,13.31 v12.47,14.61
SDA  (via drill 0.3)
  Top 0.203: J4.3 22.34,12.33 21.97,12.7 21.34,12.7 v20.7,13.34 | U1.P$8 13.73,14.17 13.39,13.83 13.14,13.83 13.13,13.84 v13.08,13.84 12.19,13.84 11.67,13.32 R10.1 10.83,11.56 9.02,11.56 6.48,9.02 5.21,9.02 J3.2
  Bottom 0.203: v20.7,13.34 20.62,13.26 13.66,13.26 v13.08,13.84
SHIELD  (via drill 0.3)
  other vias: 3.94,20.07 2.03,19.81
  pour Top (isolate 0.203, no thermals): 0.51,21.34 6.48,21.34 6.48,11.68 0.51,11.68
  pour Bottom (isolate 0.203, no thermals): 6.48,21.34 0.51,21.34 0.51,11.68 6.48,11.68
VBUS_VS_DISCH
  Top 0.203: U1.P$18 17.76,17.76 18.16,18.16 18.16,19.05 18.41,19.3 R3.1
VDD  (via drill 0.3)
  Top 0.152: v14.73,21.21 15.24,21.21 15.44,21.01 15.44,19.86 15.24,19.66 14.71,19.66 14.22,19.18 U1.P$22
  Top 0.203: D4.C v14.73,21.21 | U1.P$22
  Top 0.406: v26.29,18.29 27.43,19.43 v27.43,21.44 27.43,20.7 33.23,20.7 33.74,21.21 R13.2 R11.2 R12.2 | v23.37,10.16 22.73,9.53 21.34,9.53 | 21.34,9.53 v16.31,9.53 15.6,9.53 14.73,10.39 R2.2 R1.2 | J4.2 21.34,9.53 | S1.2 21.46,25.57 | S1.1 21.46,25.57 | v21.46,24.68 21.46,25.57
  Bottom 0.203: v23.37,10.16 21.34,10.16 21.21,10.03 JP1.2
  Bottom 0.406: v27.43,21.44 26.77,22.1 21.46,22.1 | 21.46,22.1 15.62,22.1 v14.73,21.21 | v26.29,18.29 26.29,11.46 24.99,10.16 v23.37,10.16 | v21.46,24.68 21.46,22.1 | v16.31,9.53 15.47,10.36 7.72,10.36 6.35,8.99 J3.3
VIN  (via drill 0.3)
  Top 0.203: R3.2 R5.2 21.97,17.78 22.48,17.27 v22.48,16.61 | J1.VBUS1 7.78,18.96 8.13,19.3 8.13,20.07 8.68,20.61 D5.2 C6.1 11.68,19.68 12.06,19.3 12.83,19.3 13.23,18.9 U1.P$24
  Top 0.406: J1.VBUS1 5.37,18.96 4.83,18.41 | J1.VBUS2 5.37,14.06 4.83,14.61
  Top 0.508: 4.83,14.61 4.83,18.41 3.68,18.41 3.05,19.05 3.05,22.23 1.27,24 J7.1
  Top 0.61: v8.26,13.97 8.16,14.06 J1.VBUS2
  Bottom 0.813: v8.26,13.97 10.03,12.19 21.72,12.19 22.48,12.95 v22.48,16.61
  pour Top (isolate 0.152, no thermals): 21.97,14.35 21.97,16.64 22.35,17.02 22.61,17.02 22.99,16.64 22.99,14.48 22.86,14.35
VSNK  (via drill 0.3)
  Top 0.203: R7.1 C3.1 18.71,10.71 v18.8,10.79 | D8.2 25.69,14 Q1.5@1
  Bottom 0.203: v24.77,13.08 22.71,11.02 19.02,11.02 v18.8,10.79
  pour Top (isolate 0.203, no thermals): 34.92,14.86 32.77,12.7 23.37,12.7 23.37,17.02 29.59,17.02 30.35,16.26 34.29,16.26 34.92,15.62

### Text on the board
Bottom: v10
tDocu: Alex Wende